# Altium schematic sheet cw312_template_cardedge.SchDoc: CW312 Connections
size Letter; Organization: NewAE Technology Inc.; Address1: 1083 Queen St., Suite 196; Address2: Halifax; Address3: NS; Address4: Canada B3H 0B2; DocumentNumber: .; Revision: .; SheetNumber: 1; SheetTotal: 1; SheetApproved: NO
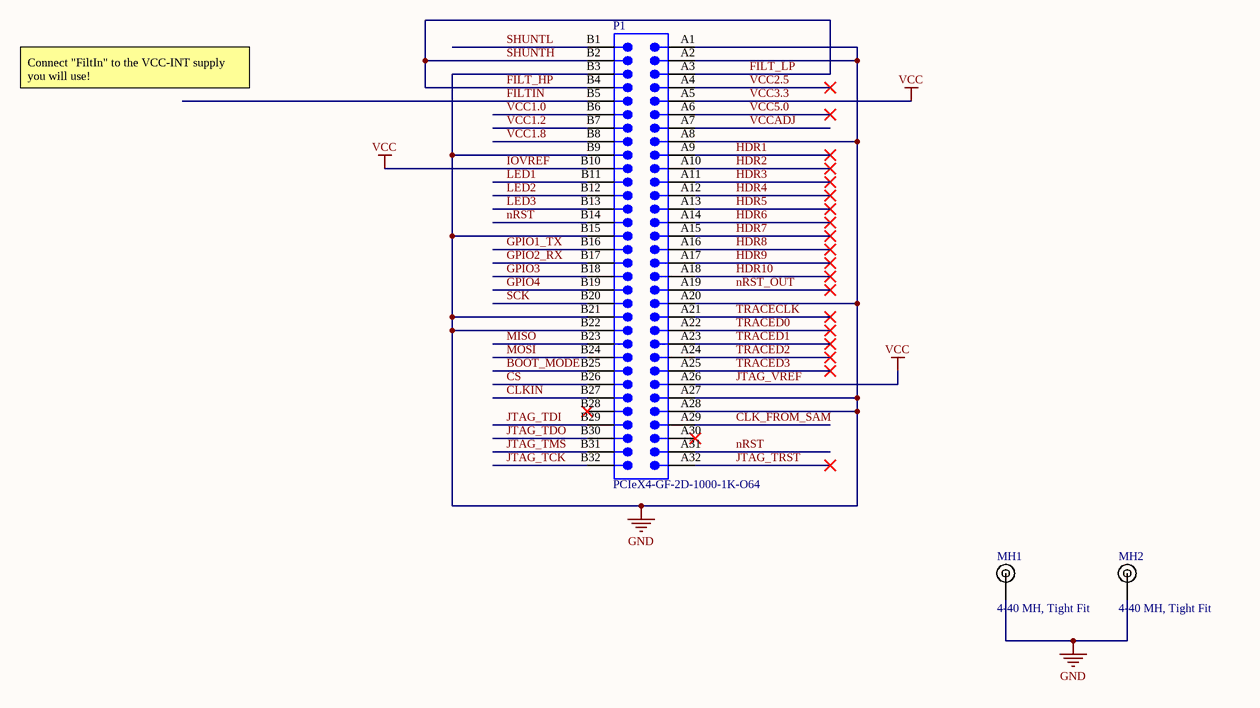
[diagram p0: cw312_template_cardedge.SchDoc]

## Parts
MH1  4-40 MH, Tight Fit  [MOUNT_#4_TIGHT]
MH2  4-40 MH, Tight Fit  [MOUNT_#4_TIGHT]
P1  PCIeX4-GF-2D-1000-1K-O64  [PCIeX4-GF-2D-1000-1K-O64]  (no BOM)

## Nets
GND: MH1.1 MH2.1 P1.A1 P1.A2 P1.A8 P1.A20 P1.A27 P1.A28 P1.B3 P1.B9 P1.B15 P1.B21 P1.B22
IOVREF: P1.A5 P1.A26 P1.B10  [also labelled JTAG_VREF, VCC, VCC3.3]
BOOT_MODE: P1.B25
CLK_FROM_SAM: P1.A29
CLKIN: P1.B27
CS: P1.B26
FILT_HP: P1.A3 P1.B2 P1.B4  [also labelled FILT_LP, SHUNTH]
FILTIN: P1.B5
GPIO1_TX: P1.B16
GPIO2_RX: P1.B17
GPIO3: P1.B18
GPIO4: P1.B19
HDR1: P1.A9
HDR2: P1.A10
HDR3: P1.A11
HDR4: P1.A12
HDR5: P1.A13
HDR6: P1.A14
HDR7: P1.A15
HDR8: P1.A16
HDR9: P1.A17
HDR10: P1.A18
JTAG_TCK: P1.B32
JTAG_TDI: P1.B29
JTAG_TDO: P1.B30
JTAG_TMS: P1.B31
JTAG_TRST: P1.A32
LED1: P1.B11
LED2: P1.B12
LED3: P1.B13
MISO: P1.B23
MOSI: P1.B24
nRST: P1.A31 P1.B14
nRST_OUT: P1.A19
SCK: P1.B20
SHUNTL: P1.B1
TRACECLK: P1.A21
TRACED0: P1.A22
TRACED1: P1.A23
TRACED2: P1.A24
TRACED3: P1.A25
VCC1.0: P1.B6
VCC1.2: P1.B7
VCC1.8: P1.B8
VCC2.5: P1.A4
VCC5.0: P1.A6
VCCADJ: P1.A7

Not connected (* = marked no-connect by the designer): P1 A30* B28*

## Notes on the sheet
- Connect "FiltIn" to the VCC-INT supply you will use!
- Title:
- Date:
- Rev:
- Time:
- Project:
- Sheet
- of
- License:
- Copyright © NewAE Technology Inc.
- Approved:
- NewAE.com
- File:

## Library data of the parts
MH1 MH2 = MOUNT_#4_TIGHT: Machine screw 4-40 Mounting Hole; Component Group: Mechanical; PP Material Stack: 0; Part Number: MOUNT_#4_TIGHT; Pin Count: 1; Component Kind: Mechanical; Component Type: Mechanical; PP Rotation: 0
P1 = CMP-0001-00031-2: Golden finger, PCIeX4, Dual, Opposite, Pitch 1mm, 64-Position; Mating Connector: Molex-87715-9106; Publisher: Altium; ClassName: Edge Connector; Datasheet Version: rev2.0, Apr-2007; Package Reference: PCIeX4-GF-2D-1000-1K-O64